# Altium project SIO2MKR.PrjPcb (part 2 of 2)

## Sheet Illustrations 2.SchDoc: Illustrations 2
size A4; ApprovedBy: LD Stanton; Author: LD Stanton; CompanyName: University of Cape Town; DrawnBy: Lawrence Stanton; Engineer: Lawrence Stanton; Organization: University of Cape Town; Address1: Department of Electrical Engineering; Address2: Rondebosch; Address3: Cape Town; Address4: South Africa 7701; DocumentNumber: 3; SheetNumber: 4; SheetTotal: 4
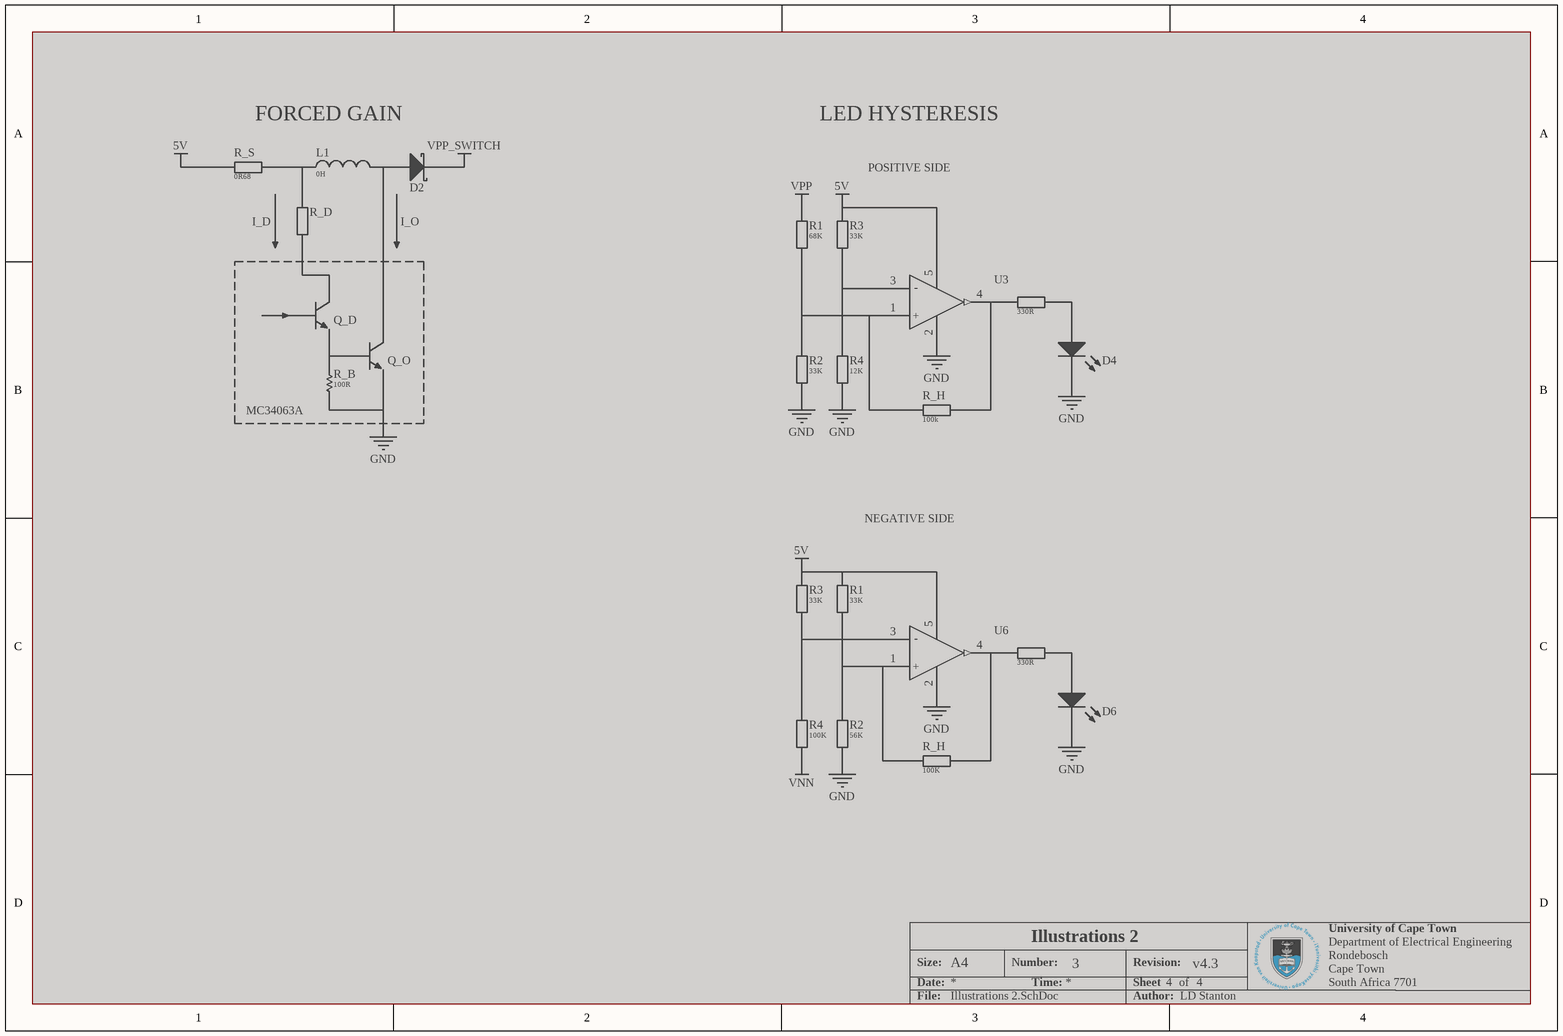
[diagram p3: Illustrations 2.SchDoc]

### Parts
(Parts that share a designator on the sheet are numbered #1, #2 ... from top to bottom, then left to right.)
D2#4  Schottky Diode Illustration  (value not drawn)  (graphical)  (masked out: inside a compile mask, not in the netlist)
D4  LED Illustration  (value not drawn)  (graphical)  (masked out: inside a compile mask, not in the netlist)
D6  LED Illustration  (value not drawn)  (graphical)  (masked out: inside a compile mask, not in the netlist)
L1#4  value 0H  (hidden comment: Inductor Illustration)  (graphical)  (masked out: inside a compile mask, not in the netlist)
Q_D  BJT NPN Illustration  (value not drawn)  (graphical)  (masked out: inside a compile mask, not in the netlist)
Q_O  BJT NPN Illustration  (value not drawn)  (graphical)  (masked out: inside a compile mask, not in the netlist)
R1#8  value 68K  (hidden comment: Resistor Box Illustration)  (graphical)  (masked out: inside a compile mask, not in the netlist)
R1#9  value 33K  (hidden comment: Resistor Box Illustration)  (graphical)  (masked out: inside a compile mask, not in the netlist)
R2#7  value 33K  (hidden comment: Resistor Box Illustration)  (graphical)  (masked out: inside a compile mask, not in the netlist)
R2#8  value 56K  (hidden comment: Resistor Box Illustration)  (graphical)  (masked out: inside a compile mask, not in the netlist)
R3#5  value 33K  (hidden comment: Resistor Box Illustration)  (graphical)  (masked out: inside a compile mask, not in the netlist)
R3#6  value 33K  (hidden comment: Resistor Box Illustration)  (graphical)  (masked out: inside a compile mask, not in the netlist)
R4#4  value 12K  (hidden comment: Resistor Box Illustration)  (graphical)  (masked out: inside a compile mask, not in the netlist)
R4#5  value 100K  (hidden comment: Resistor Box Illustration)  (graphical)  (masked out: inside a compile mask, not in the netlist)
R?#7  value 330R  (hidden comment: Resistor Box Illustration)  (graphical)  (masked out: inside a compile mask, not in the netlist)
R?#8  value 330R  (hidden comment: Resistor Box Illustration)  (graphical)  (masked out: inside a compile mask, not in the netlist)
R_B  value 100R  (hidden comment: Resistor Wire Illustration)  (graphical)  (masked out: inside a compile mask, not in the netlist)
R_D#2  Resistor Box Illustration  (value not drawn)  (graphical)  (masked out: inside a compile mask, not in the netlist)
R_H#1  value 100k  (hidden comment: Resistor Box Illustration)  (graphical)  (masked out: inside a compile mask, not in the netlist)
R_H#2  value 100K  (hidden comment: Resistor Box Illustration)  (graphical)  (masked out: inside a compile mask, not in the netlist)
R_S#3  value 0R68  (hidden comment: Resistor Box Illustration)  (graphical)  (masked out: inside a compile mask, not in the netlist)
U3#2  Op-Amp Powered Illustration  (value not drawn)  (graphical)  (masked out: inside a compile mask, not in the netlist)
U6#2  Op-Amp Powered Illustration  (value not drawn)  (graphical)  (masked out: inside a compile mask, not in the netlist)

### Blocks framed on the sheet
MC34063A: Q_D Q_O R_B

### Notes on the sheet
- FORCED GAIN
- LED HYSTERESIS
- POSITIVE SIDE
- I_D
- I_O
- NEGATIVE SIDE
- Size:
- Date:
- A4
- Number:
- Time:
- Revision:
- Sheet
- of
- File:
- Author:
- (in symbol CMP-000012-2) -; +

### Library data of the parts
D2#4 = CMP-00003-4: Schottky Diode for Ilustration; Blocking Voltage: 0V0; Forward Current: 0A0; Placement: CRITICAL; Temperature: -0 - 0°C; Forward Voltage: 0V0
D4 D6 = CMP-00004-3: LED for Ilustration; Colour: Red; Forward Voltage: 0V0; Placement: CRITICAL; Forward Current: 0A0; Temperature: -0 - 0°C
L1#4 = CMP-000009-4: General Inductor for Illustration; Rated Current: 0A; Tolerance: ±0%; Temperature Coefficient: ±0ppm/K; Placement: CRITICAL; Resistance: 0K0; Temperature: -0 - 0°C; Saturation Current: 0A
Q_D Q_O = CMP-000010-2: NPN Bipolar Junction Transistor for Illustration; Collector Current: 0A; Power: 0W; Collector-Emitter Voltage: 0V; Placement: CRITICAL; Saturation Voltgae: 0V; Temperature: -0 - 0°C
R1#8 R1#9 R2#7 R2#8 R3#5 R3#6 R4#4 R4#5 R?#7 R?#8 R_H#1 R_H#2 R_S#3 = CMP-010-000360-14: Resistor for Illustration. Box Symbol.; Working Voltage: 0V; Power: 0W; Placement: CRITICAL; Tolerance: ±0%; Temperature Coefficient: ±0ppm/K; Package: 0000; Temperature: -0 - 0°C
R_B = CMP-010-000361-6: Resistor for Illustration. Wire Symbol.; Temperature Coefficient: ±0ppm/K; Placement: CRITICAL; Power: 0W; Tolerance: ±0%; Working Voltage: 0V; Temperature: -0 - 0°C; Package: 0000
R_D#2 = CMP-010-000360-14: Resistor for Illustration. Box Symbol.; Value: 0K0; Working Voltage: 0V; Power: 0W; Placement: CRITICAL; Tolerance: ±0%; Temperature Coefficient: ±0ppm/K; Package: 0000; Temperature: -0 - 0°C
U3#2 U6#2 = CMP-000012-2: Operational Amplifier with Power Pins for Illustration; Placement: CRITICAL; Temperature: -0 - 0°C

## Sheet Illustrations 3.SchDoc: Illustrations 3
size A4; ApprovedBy: LD Stanton; Author: LD Stanton; CompanyName: University of Cape Town; DrawnBy: Lawrence Stanton; Engineer: Lawrence Stanton; Organization: University of Cape Town; Address1: Department of Electrical Engineering; Address2: Rondebosch; Address3: Cape Town; Address4: South Africa 7701; DocumentNumber: 1; SheetNumber: 1; SheetTotal: 1
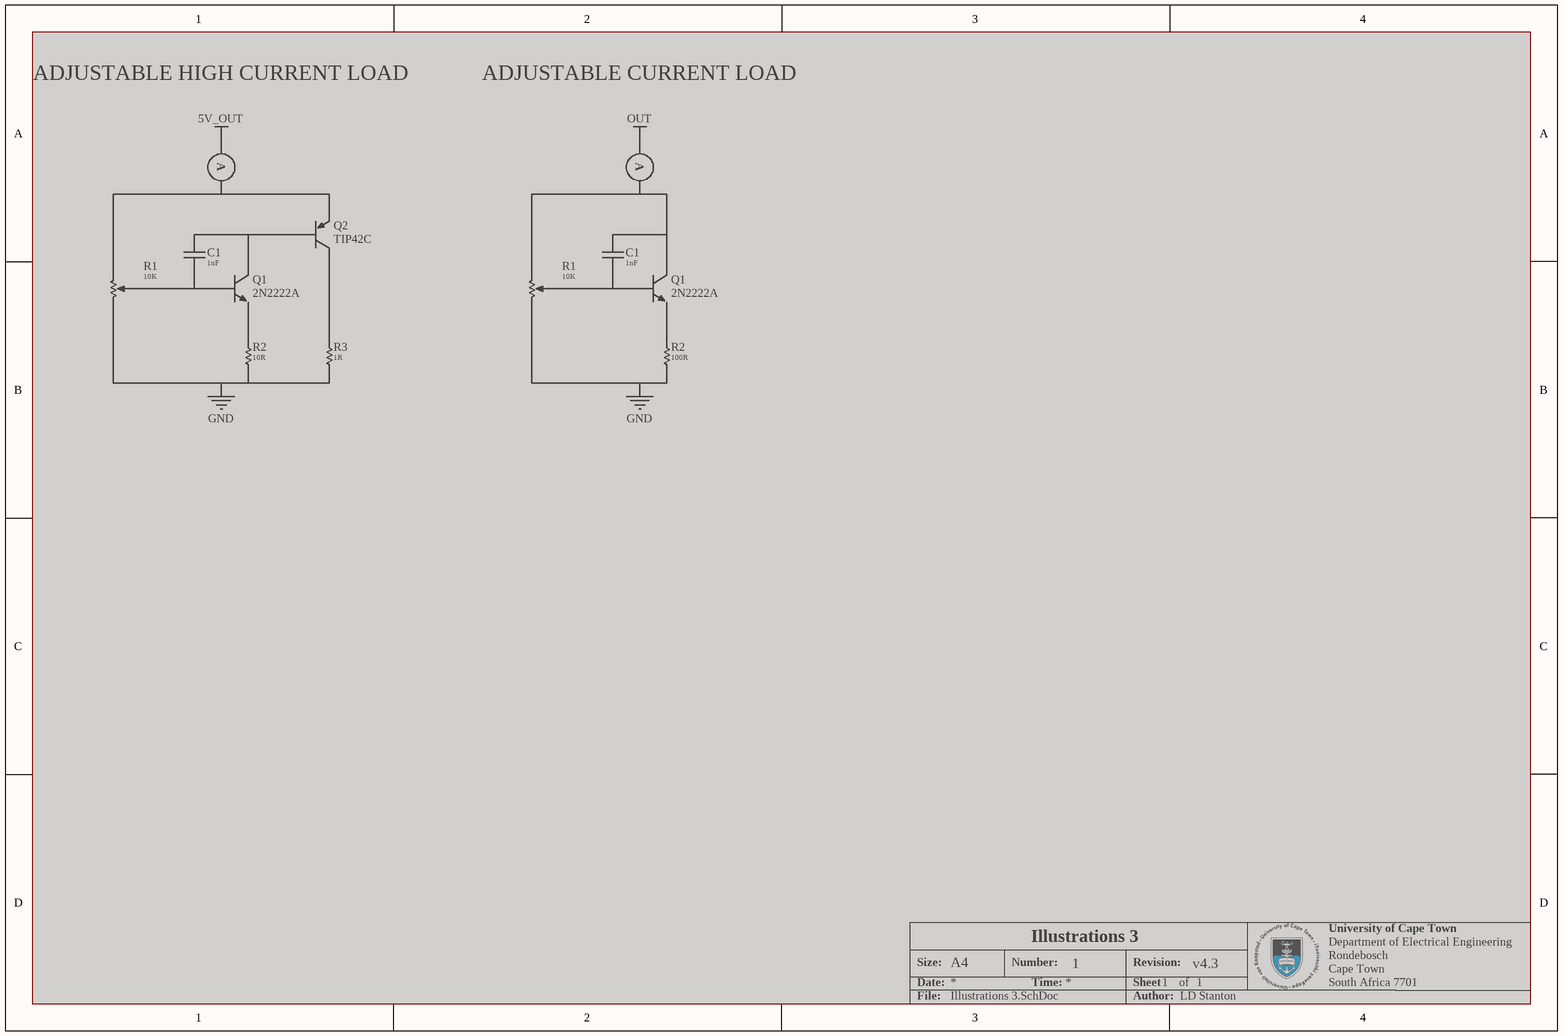
[diagram p4: Illustrations 3.SchDoc]

### Parts
(Parts that share a designator on the sheet are numbered #1, #2 ... from top to bottom, then left to right.)
C1#4  value 1nF  (hidden comment: Capacitor Non-Polarised Illustration)  (graphical)  (masked out: inside a compile mask, not in the netlist)
C1#5  value 1nF  (hidden comment: Capacitor Non-Polarised Illustration)  (graphical)  (masked out: inside a compile mask, not in the netlist)
M?#1  Ammeter Illustration  (value not drawn)  (graphical)  (masked out: inside a compile mask, not in the netlist)
M?#2  Ammeter Illustration  (value not drawn)  (graphical)  (masked out: inside a compile mask, not in the netlist)
Q1#5  2N2222A  (graphical)  (masked out: inside a compile mask, not in the netlist)
Q1#6  2N2222A  (graphical)  (masked out: inside a compile mask, not in the netlist)
Q2#4  TIP42C  (graphical)  (masked out: inside a compile mask, not in the netlist)
R1#10  value 10K  (hidden comment: Potentiometer Illustration)  (graphical)  (masked out: inside a compile mask, not in the netlist)
R1#11  value 10K  (hidden comment: Potentiometer Illustration)  (graphical)  (masked out: inside a compile mask, not in the netlist)
R2#9  value 10R  (hidden comment: Resistor Wire Illustration)  (graphical)  (masked out: inside a compile mask, not in the netlist)
R2#10  value 100R  (hidden comment: Resistor Wire Illustration)  (graphical)  (masked out: inside a compile mask, not in the netlist)
R3#7  value 1R  (hidden comment: Resistor Wire Illustration)  (graphical)  (masked out: inside a compile mask, not in the netlist)

### Notes on the sheet
- ADJUSTABLE HIGH CURRENT LOAD
- ADJUSTABLE CURRENT LOAD
- Size:
- Date:
- A4
- Number:
- Time:
- Revision:
- Sheet
- of
- File:
- Author:
- (in symbol CMP-00040-3) A

### Library data of the parts
C1#4 C1#5 = CMP-000003-10: Non-Polarised Capacitor for Illustration.; Tolerance: ±0%; Temperature Coefficient: ±0ppm/K; Placement: CRITICAL; Voltage: 0V; Package: 0000; Temperature: -0 - 0°C
M?#1 M?#2 = CMP-00040-3: Ammeter for Illustration; Placement: CRITICAL
Q1#5 Q1#6 = CMP-000010-3: NPN Bipolar Junction Transistor for Illustration; Collector Current: 0A; Collector-Emitter Voltage: 0V; Power: 0W; Placement: CRITICAL; Temperature: -0 - 0°C; Saturation Voltgae: 0V
Q2#4 = CMP-00002-3: PNP Bipolar Junction Transistor for Illustration; Placement: CRITICAL; Collector-Emitter Voltage: 0V; Power: 0W; Collector Current: 0A; Saturation Voltgae: 0V; Temperature: -0 - 0°C
R1#10 R1#11 = CMP-010-000362-3: Potentiometer for Illustration.; Working Voltage: 0V; Placement: CRITICAL; Power: 0W; Temperature Coefficient: ±0ppm/K; Tolerance: ±0%; Temperature: -0 - 0°C
R2#9 R2#10 R3#7 = CMP-010-000361-6: as R_B on sheet Illustrations 2; Temperature: -0 - 0°C; Package: 0000

## Assembly variants
JLCPCB SMT Assembley: not fitted C4 C10 C16 C21 P2 P3 P4 P5 P6 R1; alternate parts C11 -> Cap Tant 100uF 16V Kemet, C12 -> Cap Tant 100uF 16V Kemet, C13 -> Cap Tant 100uF 16V Kemet, C14 -> Cap Tant 100uF 16V Kemet, C22 -> Cap Tant 100uF 16V Kemet, C23 -> Cap Tant 100uF 16V Kemet, C24 -> Cap Tant 100uF 16V Kemet, C25 -> Cap Tant 100uF 16V Kemet